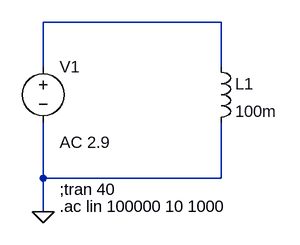
[diagram p0: schematic lab2_inductor.asc]
lab2_inductor.asc, the LTspice schematic file:
Version 4
SHEET 1 880 680
WIRE 352 96 96 96
WIRE 96 160 96 96
WIRE 352 160 352 96
WIRE 96 320 96 240
WIRE 352 320 352 240
WIRE 352 320 96 320
WIRE 96 368 96 320
FLAG 96 368 0
SYMBOL voltage 96 144 R0
WINDOW 123 24 124 Left 2
WINDOW 39 0 0 Left 0
WINDOW 3 24 96 Invisible 2
SYMATTR Value2 AC 2.9
SYMATTR InstName V1
SYMATTR Value SINE(0 2.9 10)
SYMBOL ind 336 144 R0
SYMATTR InstName L1
SYMATTR Value 100m
TEXT 120 336 Left 2 !;tran 40
TEXT 120 360 Left 2 !.ac lin 100000 10 1000

The netlist it stands for:
* lab2_inductor.asc
V1 N001 0 SINE(0 2.9 10) AC 2.9
L1 N001 0 100m
;tran 40
.ac lin 100000 10 1000
.backanno
.end